# EasyEDA Pro project smart-switch-v2.eprj, board bus-board
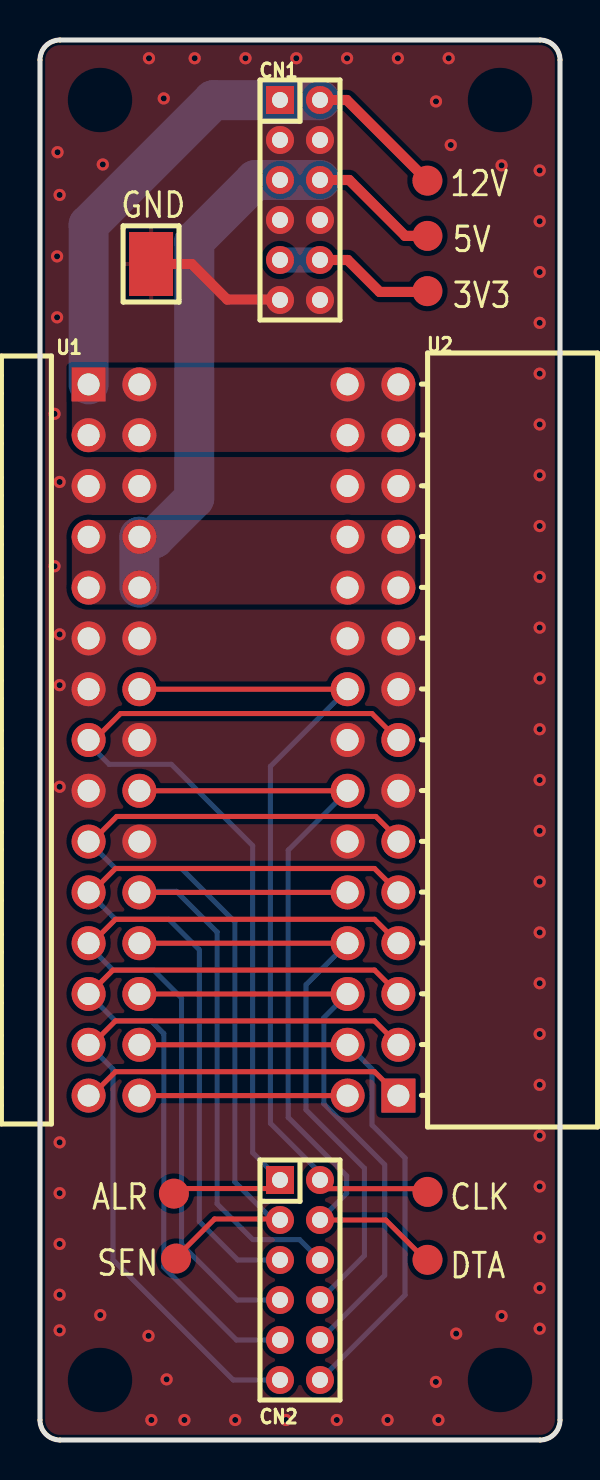
[diagram p7: board, top side]
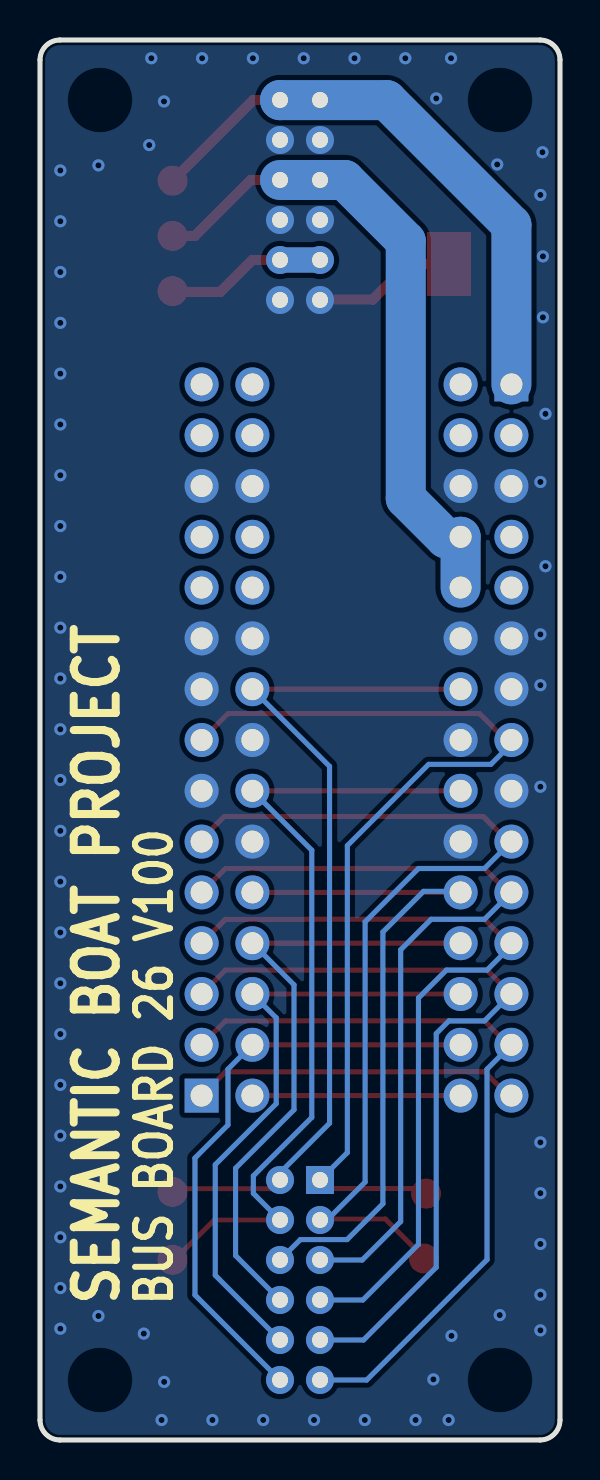
[diagram p8: board, bottom side, seen from below]

Outline 26 x 70 mm; copper layers: Top Layer, Inner1, Inner2, Bottom Layer. Coordinates in mm from the lower left corner of the outline.
Outline path: 0,69 0,1 arc(0.29,0.29) 1,0 25,0 arc(25.71,0.29) 26,1 26,69 arc(25.71,69.71) 25,70 1,70 arc(0.29,69.71) 0,69
Stack: Top Layer 0.035mm Outer layer thickness 1oz / Dielectric1 0.2104mm 7628 RC49% 8.6mil / Inner1 0.0152mm Inner layer thickness / Dielectric2 1.065mm 1.1mm H/HOZ Copper / Inner2 0.0152mm Inner layer thickness / Dielectric3 0.2104mm 7628 RC49% 8.6mil / Bottom Layer 0.035mm Outer layer thickness 1oz

## Design rules (mm)
net GND: power
net +5V: power
net +12V: power
net +3V3: power
template: Custom Config
spacing copperThickness1oz (default): track to track 0.102, other pairs 0.152 to 0.3
spacing copperThickness2oz: track to track 0.203, other pairs 0.152 to 0.3
spacing copperThicknessInner0.5oz: track to track 0.089, other pairs 0.152 to 0.3
track width copperThickness1oz (default): min 0.102, default 0.254, max 2.54
track width copperThickness2oz: min 0.203, default 0.254, max 2.54
track width copperThickness0.5oz: min 0.089, default 0.254, max 2.54
track width power: min 0.127, default 1.27, max 50
differential pair differentialPair (default): width min 0.127, default 0.254, max 2.54; gap min 0.152, default 0.152
via viaSize (default): diameter min 0.3, default 0.61, max 10; hole min 0.2, default 0.305, max 6.3
via power: diameter min 0.5, default 1, max 10; hole min 0.3, default 0.5, max 6.3
net class power uses power
net GND uses power
net +5V uses power
net +12V uses power
net +3V3 uses power

## Placement (name value [footprint] x y rotation side)
CN1  PH2.0-01-06PZS  [HDR-TH_12P-P2.00-V-M-R2-C6-S2.00]  13 62 270 top
CN2  PH2.0-01-06PZS  [HDR-TH_12P-P2.00-V-M-R2-C6-S2.00]  13 8 270 top
CN4  RH-5016  [TESTPOINT-SMD_L3.0-W2.0]  5.55 58.8 90 top
TP1  -  [Test-Point-0.5mm]  19.37 62.97 0 top
TP2  -  [Test-Point-0.5mm]  19.37 60.2 0 top
TP3  -  [Test-Point-0.5mm]  19.37 57.44 0 top
TP4  -  [Test-Point-0.5mm]  19.38 12.41 0 top
TP5  -  [Test-Point-0.5mm]  19.38 9.01 0 top
TP6  -  [Test-Point-0.5mm]  6.7 12.32 0 top
TP7  -  [Test-Point-0.5mm]  6.8 9.07 0 top
U1  XDZ254-2-15-W-2.5-G1  [HDR-TH_30P-P2.54-H-M-R2-C15-S2.54-N]  3.7 35 270 top
U2  PM254-2-15-W-8.5  [HDR-TH_30P-P2.54-H-F-R2-C15-W8.5]  16.65 35 90 top

## Footprints (pads in the part's own frame, mm; a bottom-side part is the same pattern mirrored in y, then rotated)
HDR-TH_12P-P2.00-V-M-R2-C6-S2.00
  rect 1.4x1.4 hole 0.8: 1(-5,-1)
  round 1.4 hole 0.8: 2(-5,1) 3(-3,-1) 4(-3,1) 5(-1,-1) 6(-1,1) 7(1,-1) 8(1,1) 9(3,-1) 10(3,1) 11(5,-1) 12(5,1)
HDR-TH_30P-P2.54-H-F-R2-C15-W8.5
  rect 1.7x1.7 hole 1.1: 1(-17.78,-1.27)
  round 1.7 hole 1.1: 2(-17.78,1.27) 3(-15.24,-1.27) 4(-15.24,1.27) 5(-12.7,-1.27) 6(-12.7,1.27) 7(-10.16,-1.27) 8(-10.16,1.27) 9(-7.62,-1.27) 10(-7.62,1.27) 11(-5.08,-1.27) 12(-5.08,1.27) 13(-2.54,-1.27) 14(-2.54,1.27) 15(0,-1.27) 16(0,1.27) 17(2.54,-1.27) 18(2.54,1.27) 19(5.08,-1.27) 20(5.08,1.27) 21(7.62,-1.27) 22(7.62,1.27) 23(10.16,-1.27) 24(10.16,1.27) 25(12.7,-1.27) 26(12.7,1.27) 27(15.24,-1.27) 28(15.24,1.27) 29(17.78,-1.27) 30(17.78,1.27)
HDR-TH_30P-P2.54-H-M-R2-C15-S2.54-N
  rect 1.7x1.7 hole 1.1: 1(-17.78,-1.27)
  round 1.7 hole 1.1: 2(-17.78,1.27) 3(-15.24,-1.27) 4(-15.24,1.27) 5(-12.7,-1.27) 6(-12.7,1.27) 7(-10.16,-1.27) 8(-10.16,1.27) 9(-7.62,-1.27) 10(-7.62,1.27) 11(-5.08,-1.27) 12(-5.08,1.27) 13(-2.54,-1.27) 14(-2.54,1.27) 15(0,-1.27) 16(0,1.27) 17(2.54,-1.27) 18(2.54,1.27) 19(5.08,-1.27) 20(5.08,1.27) 21(7.62,-1.27) 22(7.62,1.27) 23(10.16,-1.27) 24(10.16,1.27) 25(12.7,-1.27) 26(12.7,1.27) 27(15.24,-1.27) 28(15.24,1.27) 29(17.78,-1.27) 30(17.78,1.27)
Test-Point-0.5mm
  round 1.5 smd: 1(0,0)
TESTPOINT-SMD_L3.0-W2.0
  rect 3.2x2.2 smd: 1(0,0)

## Nets
As in the schematic.

## Via types
v1: diameter 0.61, hole 0.305, Top Layer to Bottom Layer, 64 vias

## Routing (per net, layer and track width the routed paths; a pad name or vN(x,y) marks a point on that pad's centre or on a via; arc(x,y) is an arc through that point)
+3V3: length 8
  Top Layer w0.508: CN1.10 15.39,59 16.98,57.4 19.33,57.4 TP3.1
  Bottom Layer w1.27: CN1.9 CN1.10
+5V: length 33.1
  Top Layer w0.508: TP2.1 18.25,60.2 15.46,63 CN1.6
  Bottom Layer w2: CN1.6 CN1.5 10.77,63 7.71,59.94 7.71,47.08 5.71,45.08 5.04,45.08 U1.8 U1.10
+12V: length 29.2
  Top Layer w0.508: CN1.2 15.34,67 TP1.1
  Bottom Layer w2: U1.1 2.43,60.76 8.66,66.99 13.99,66.99 CN1.2
GND: length 7.2
  Top Layer w0.508: CN1.11 12.02,57.02 9.36,57.02 7.59,58.8 CN4.1
  vias: v1(0.73,51.31) v1(0.73,43.69) v1(0.88,64.39) v1(0.85,59.18) v1(0.85,56.13) v1(0.98,62.25) v1(0.98,47.9) v1(0.98,40.28) v1(0.98,37.74) v1(0.98,32.66) v1(0.98,14.88) v1(0.98,12.34) v1(0.98,9.8) v1(0.98,7.26) v1(0.98,5.48) v1(3.01,6.25) v1(3.14,63.78) v1(5.45,69.09) v1(5.43,5.21) v1(5.57,1) v1(6.19,67.08) v1(6.33,3.03) v1(7.22,1) v1(7.73,69.09) v1(9.76,1) v1(10.27,69.09) v1(12.3,1) v1(12.81,69.09) v1(14.84,1) v1(15.35,69.09) v1(17.38,1) v1(17.89,69.09) v1(19.8,66.93) v1(19.79,2.91) v1(19.92,1) v1(20.43,69.09) v1(20.54,64.75) v1(20.81,5.32) v1(23.08,63.73) v1(23.08,6.2) v1(24.98,63.48) v1(24.98,60.94) v1(24.98,58.4) v1(24.98,55.86) v1(24.98,53.32) v1(24.98,50.78) v1(24.98,48.24) v1(24.98,45.7) v1(24.98,43.16) v1(24.98,40.62) v1(24.98,38.08) v1(24.98,35.54) v1(24.98,33) v1(24.98,30.46) v1(24.98,27.92) v1(24.98,25.38) v1(24.98,22.84) v1(24.98,20.3) v1(24.98,17.76) v1(24.98,15.22) v1(24.98,12.68) v1(24.98,10.14) v1(24.98,7.6) v1(24.98,5.57)
SB_RES0: length 35.1
  Top Layer w0.254: U1.22 U2.10
  Bottom Layer w0.254: U1.22 5.02,27.43 6.82,27.43 8.85,25.4 8.85,11.81 10.65,10.02 12.98,10.02 CN2.6
SB_RES1: length 41.6
  Top Layer w0.254: U2.9 16.72,28.58 3.78,28.58 2.58,27.38 U1.21
  Bottom Layer w0.254: U1.21 3.78,26.03 6.44,26.03 7.97,24.51 7.97,10.92 9.89,9 CN2.5
SB_RES2: length 31.2
  Top Layer w0.254: U1.24 U2.8
  Bottom Layer w0.254: CN2.8 16.22,9.22 16.22,13.59 13.3,16.51 13.3,22.76 U2.8
SB_RES3: length 40.7
  Top Layer w0.254: U2.7 16.72,26.03 3.78,26.03 2.58,24.84 U1.23
  Bottom Layer w0.254: CN2.7 9.86,7 7.08,9.78 7.08,22.1 5.68,23.5 3.65,23.5 2.43,24.71 U1.23
SB_RES4: length 30.8
  Top Layer w0.254: U1.26 U2.6
  Bottom Layer w0.254: CN2.10 17.24,8.24 17.24,13.77 14.19,16.81 14.19,21.11 U2.6
SB_RES5: length 40.1
  Top Layer w0.254: U2.5 16.72,23.5 3.65,23.5 2.45,22.3 U1.25
  Bottom Layer w0.254: U1.25 3.78,20.95 5.55,20.95 6.19,20.32 6.19,8.64 9.82,5 CN2.9
SB_RES6: length 30.1
  Top Layer w0.254: U1.28 U2.4
  Bottom Layer w0.254: U2.4 15.38,19.76 16.6,18.54 16.6,15.75 18.25,14.1 18.25,7.25 CN2.12
SB_RES7: length 38.6
  Top Layer w0.254: U2.3 16.72,20.95 3.78,20.95 2.58,19.76 U1.27
  Bottom Layer w0.254: CN2.11 9.66,3 3.65,9.02 3.65,18.54 U1.27
SB_RES8: length 10.4
  Top Layer w0.254: U1.30 U2.2
SB_RES9: length 16.5
  Top Layer w0.254: U1.29 2.58,17.22 3.78,18.42 16.72,18.42 U2.1
SMBUS_ALERT: length 50
  Top Layer w0.254: U2.15 16.6,36.32 4.03,36.32 2.71,35 U1.15 ; TP6.1 6.95,12.57 11.57,12.57 CN2.1
  Bottom Layer w0.254: U1.15 2.43,34.81 3.46,33.78 6.57,33.78 10.63,29.72 10.63,14.37 CN2.1
SMBUS_CLK: length 43.3
  Top Layer w0.254: 19.38,11.9 19.34,11.86 ; TP4.1 19.21,12.57 14.43,12.57 CN2.2 ; U1.14 U2.18
  Bottom Layer w0.254: U2.18 11.52,33.68 11.52,15.84 14,13.36 CN2.2
SMBUS_DATA: length 41.4
  Top Layer w0.254: TP5.1 19.28,9.01 ; 19.28,9.01 17.29,11 CN2.4 ; 19.28,9.01 18.9,9.01 ; U1.18 U2.14
  Bottom Layer w0.254: U2.14 12.41,29.49 12.41,16.13 15.33,13.21 15.33,12.33 CN2.4
STACK_ENABLED: length 47.7
  Top Layer w0.254: U2.11 17.92,30.05 16.79,31.18 3.84,31.18 2.58,29.92 U1.19 ; CN2.3 11.95,11.05 8.73,11.05 6.8,9.12 TP7.1
  Bottom Layer w0.254: CN2.3 11.64,11 9.74,12.9 9.74,25.91 7.08,28.58 3.78,28.58 U1.19

## Copper pours and planes (outline as drawn; the poured copper is in the pictures)
+5V on Top Layer: 1.59,45.99 18.76,45.99 18.76,41.78 1.59,41.78
+12V on Top Layer: 1.59,53.62 18.76,53.62 18.76,49.4 1.59,49.4
GND on Top Layer: -3.08,72.14 29.3,72.14 29.3,-3.18 -3.08,-3.18
GND on Bottom Layer: -3.59,72.26 29.3,72.26 29.3,-3.05 -3.59,-3.05
GND on Inner1: -4.73,71.88 31.46,71.88 31.46,-5.33 -4.73,-5.33
GND on Inner1: -9.69,75.69 36.67,75.69 36.67,-9.53 -9.69,-9.53
GND on Inner2: -3.59,72.52 30.06,72.52 30.06,-2.92 -3.59,-2.92

## Text on the board
Bottom Silkscreen Layer: BUS BOARD 26 V100 | SEMANTIC BOAT PROJECT
Top Silkscreen Layer: ALR | SEN | 12V | CLK | DTA | 5V | 3V3 | GND
